# EAGLE design Test_Schematic_V3 (EAGLE 9.3.0)
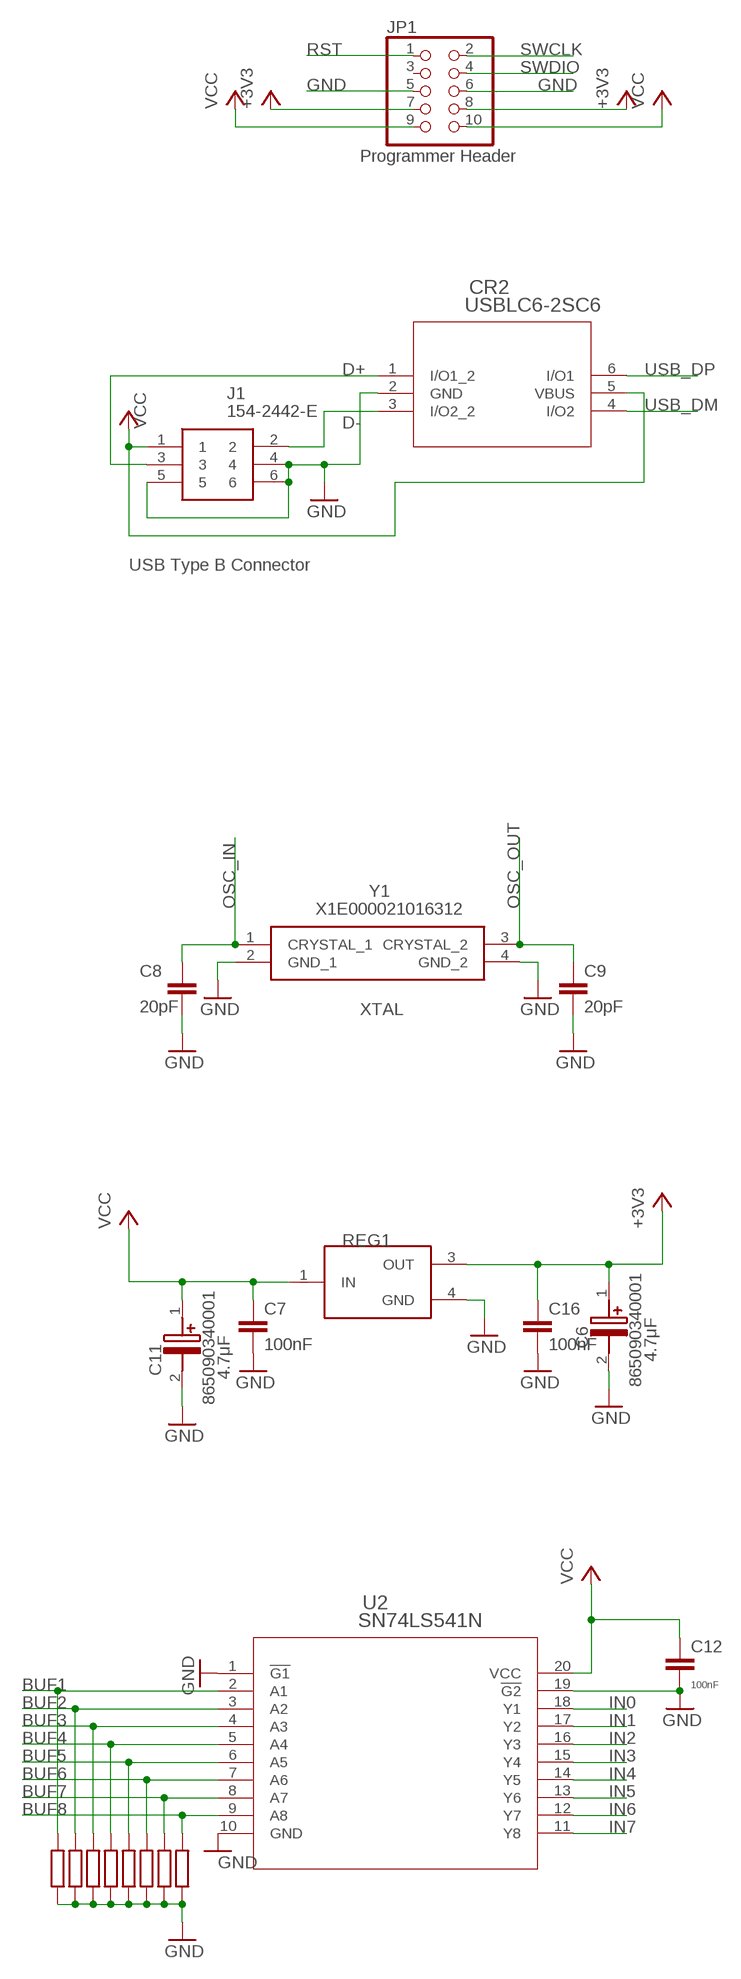
[diagram p0: schematic, sheet 1, part 1 of 2]
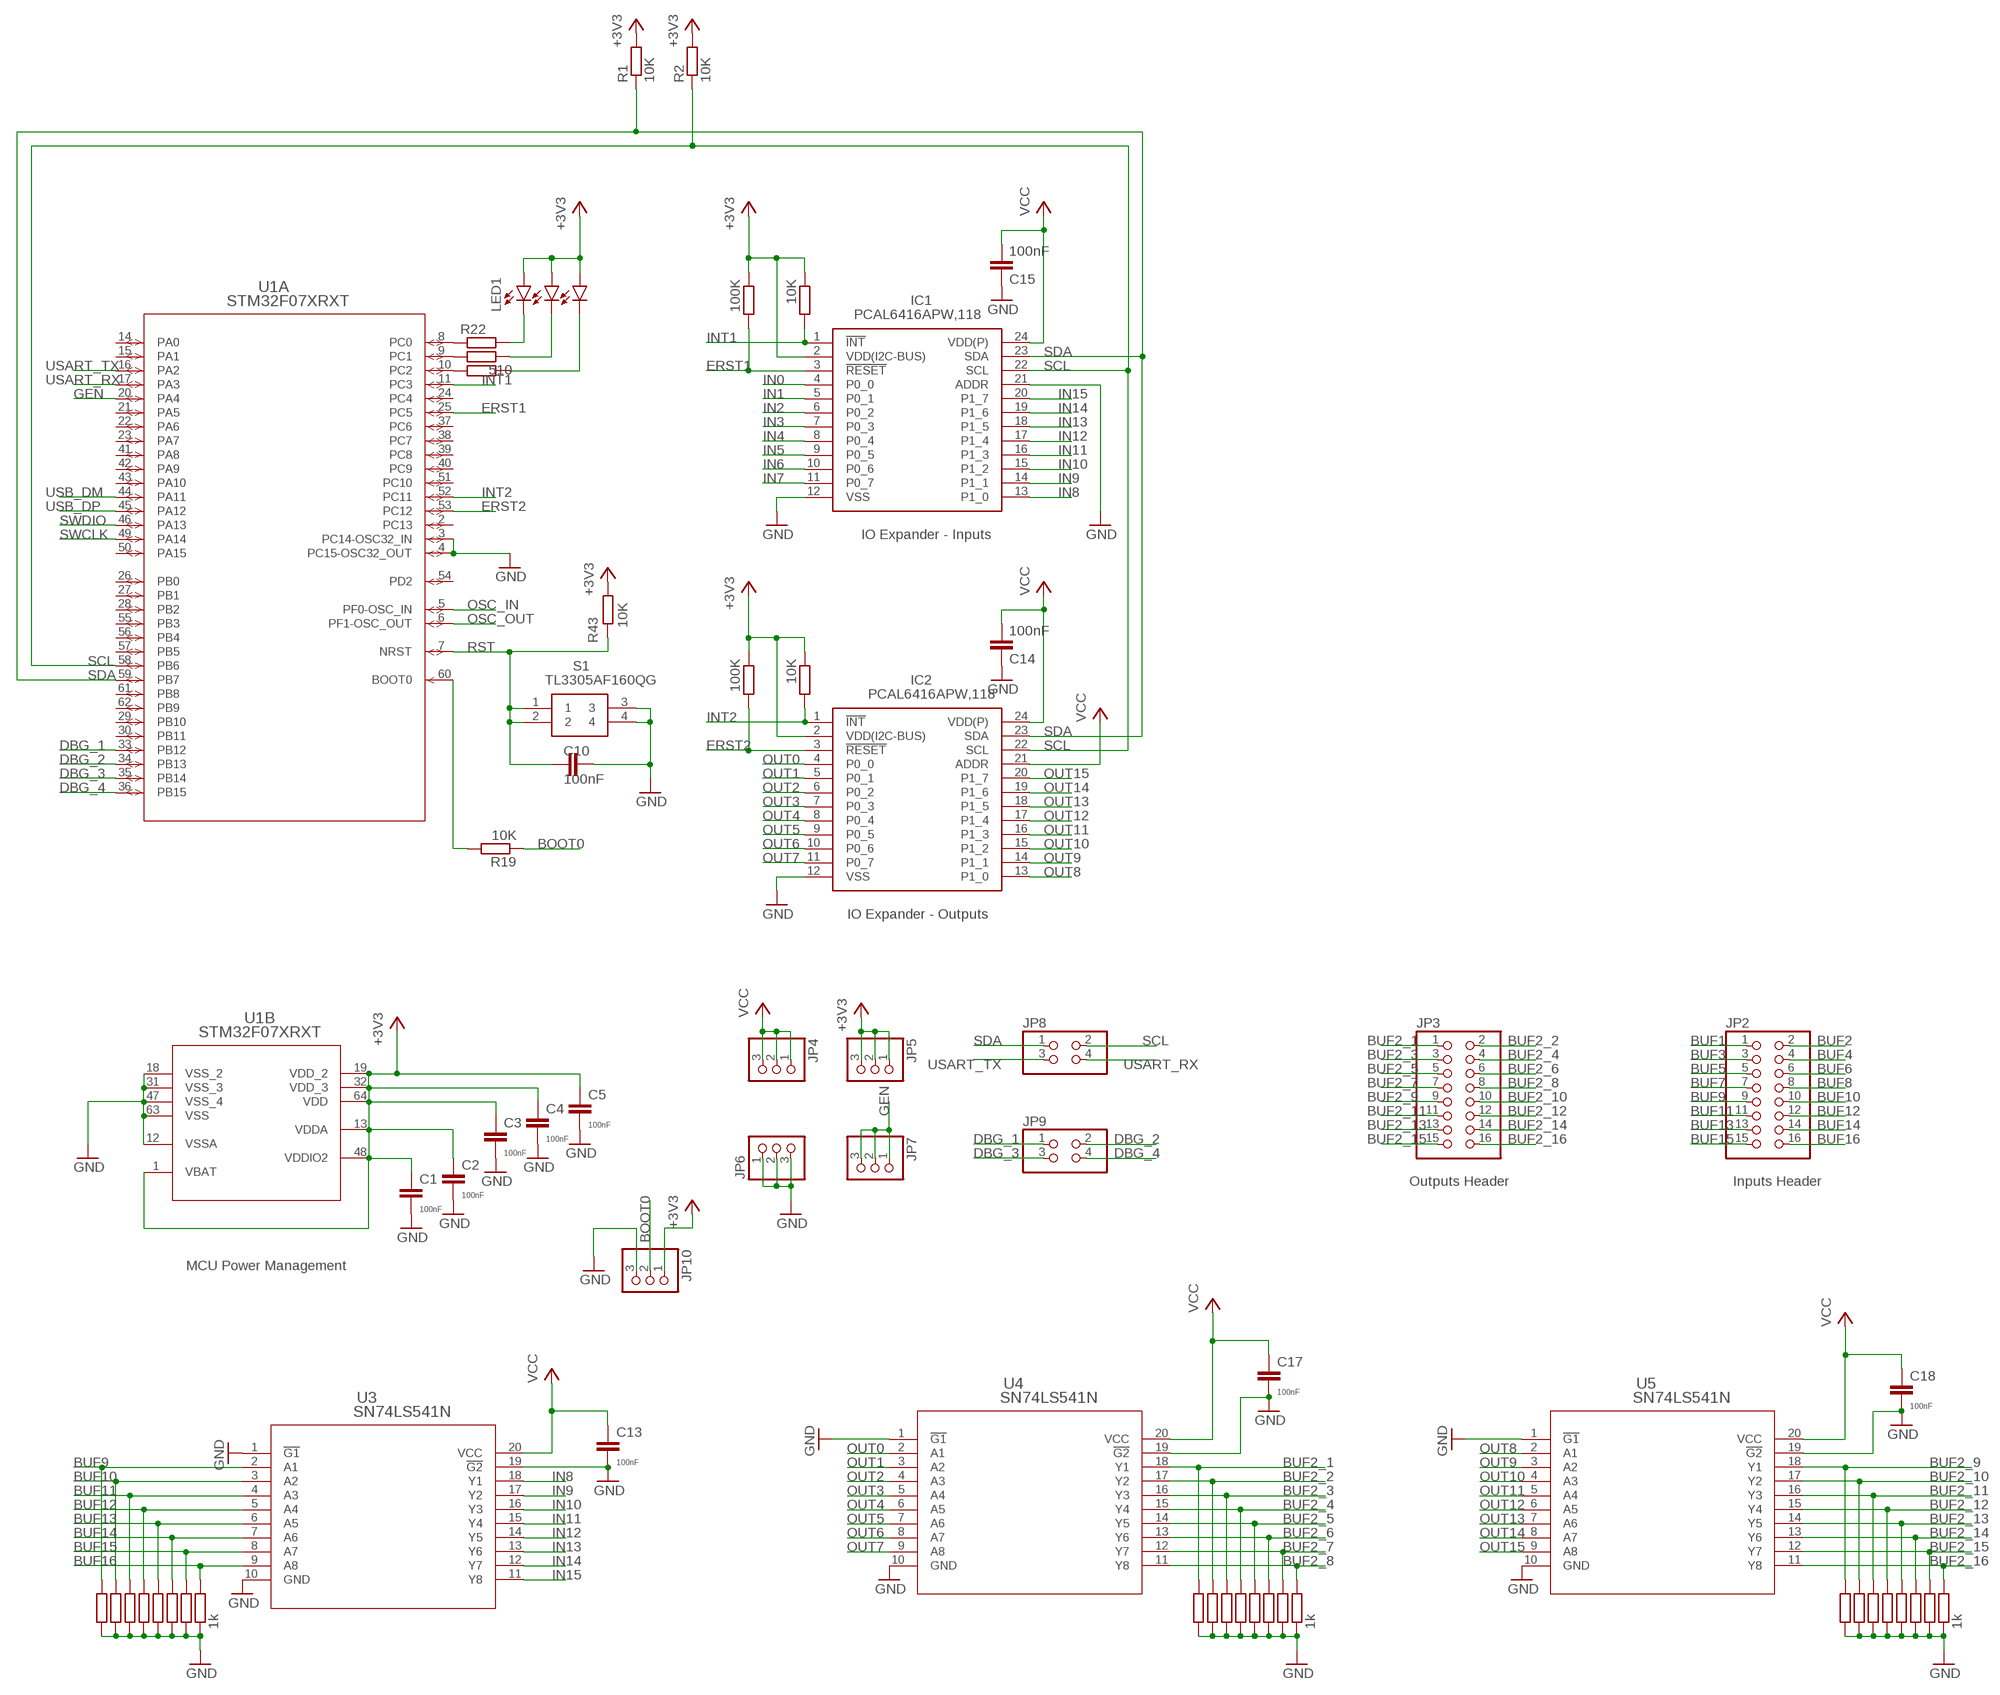
[diagram p1: schematic, sheet 1, part 2 of 2]

## Parts
C1  100nF  C-EUC1206  [C1206]
C2  100nF  C-EUC1206  [C1206]
C3  100nF  C-EUC1206  [C1206]
C4  100nF  C-EUC1206  [C1206]
C5  100nF  C-EUC1206  [C1206]
C6  865090340001  [CAPAE430X550N]
C7  100nF  C-EUC1206  [C1206]
C8  20pF  C-EUC0805K  [C0805K]
C9  20pF  C-EUC0805K  [C0805K]
C10  100nF  C-EUC1206  [C1206]
C11  865090340001  [CAPAE430X550N]
C12  100nF  C-EUC1206  [C1206]
C13  100nF  C-EUC1206  [C1206]
C14  100nF  C-EUC1206  [C1206]
C15  100nF  C-EUC1206  [C1206]
C16  100nF  C-EUC1206  [C1206]
C17  100nF  C-EUC1206  [C1206]
C18  100nF  C-EUC1206  [C1206]
CR2  USBLC6-2SC6  [SOT23-6L]
IC1  PCAL6416APW,118  [SOP65P640X110-24N]
IC2  PCAL6416APW,118  [SOP65P640X110-24N]
J1  154-2442-E  [1542442E]
JP1  PINHD-2X5  [2X05]
JP2  PINHD-2X8  [2X08]
JP3  PINHD-2X8  [2X08]
JP4  PINHD-1X3  [1X03]
JP5  PINHD-1X3  [1X03]
JP6  PINHD-1X3  [1X03]
JP7  PINHD-1X3  [1X03]
JP8  PINHD-2X2  [2X02]
JP9  PINHD-2X2  [2X02]
JP10  PINHD-1X3  [1X03]
LED1  LEDCHIP-LED0805  [CHIP-LED0805]
LED2  LEDCHIP-LED0805  [CHIP-LED0805]
LED3  LEDCHIP-LED0805  [CHIP-LED0805]
R1  10K  R-EU_R2010  [R2010]
R2  10K  R-EU_R2010  [R2010]
R11  R-EU_R0805  [R0805]
R12  R-EU_R0805  [R0805]
R13  R-EU_R0805  [R0805]
R14  R-EU_R0805  [R0805]
R15  R-EU_R0805  [R0805]
R16  R-EU_R0805  [R0805]
R17  R-EU_R0805  [R0805]
R18  1k  R-EU_R0805  [R0805]
R19  10K  R-EU_R2010  [R2010]
R20  100K  R-EU_R2010  [R2010]
R21  100K  R-EU_R2010  [R2010]
R22  R-EU_R0805  [R0805]
R23  R-EU_R0805  [R0805]
R24  510  R-EU_R0805  [R0805]
R25  10K  R-EU_R2010  [R2010]
R26  10K  R-EU_R2010  [R2010]
R27  1k  R-EU_R0805  [R0805]
R28  R-EU_R0805  [R0805]
R29  R-EU_R0805  [R0805]
R30  R-EU_R0805  [R0805]
R31  R-EU_R0805  [R0805]
R32  R-EU_R0805  [R0805]
R33  R-EU_R0805  [R0805]
R34  R-EU_R0805  [R0805]
R43  10K  R-EU_R0805  [R0805]
R44  1k  R-EU_R0805  [R0805]
R45  R-EU_R0805  [R0805]
R46  R-EU_R0805  [R0805]
R47  R-EU_R0805  [R0805]
R48  R-EU_R0805  [R0805]
R49  R-EU_R0805  [R0805]
R50  R-EU_R0805  [R0805]
R51  R-EU_R0805  [R0805]
R52  1k  R-EU_R0805  [R0805]
R53  R-EU_R0805  [R0805]
R54  R-EU_R0805  [R0805]
R55  R-EU_R0805  [R0805]
R56  R-EU_R0805  [R0805]
R57  R-EU_R0805  [R0805]
R58  R-EU_R0805  [R0805]
R59  R-EU_R0805  [R0805]
REG1  LF33ABDT  [DPAK]
S1  TL3305AF160QG  [TL3305AF160QG]
U1  STM32F07XRXT  [LQFP64-10X10MM]
U2  SN74LS541N  [N20]
U3  SN74LS541N  [N20]
U4  SN74LS541N  [N20]
U5  SN74LS541N  [N20]
Y1  X1E000021016312  [TSX-3225_2]

## Nets
+3V3: C1.1 C2.1 C3.1 C4.1 C5.1 C6.1(+) C16.1 IC1.2(VDD(I2C-BUS)) IC2.2(VDD(I2C-BUS)) JP1.7 JP1.8 JP5.1 JP5.2 JP5.3 JP10.1 LED1.A LED2.A LED3.A R1.2 R2.2 R20.1 R21.1 R25.1 R26.1 R43.1 REG1.3(OUT) U1.1(B:VBAT) U1.13(B:VDDA) U1.19(B:VDD_2) U1.32(B:VDD_3) U1.48(B:VDDIO2) U1.64(B:VDD)
BOOT0: JP10.2 R19.1
BUF1: JP2.1 R11.2 U2.2(A1)
BUF2: JP2.2 R12.2 U2.3(A2)
BUF2_1: JP3.1 R51.2 U4.18(Y1)
BUF2_2: JP3.2 R50.2 U4.17(Y2)
BUF2_3: JP3.3 R49.2 U4.16(Y3)
BUF2_4: JP3.4 R48.2 U4.15(Y4)
BUF2_5: JP3.5 R47.2 U4.14(Y5)
BUF2_6: JP3.6 R46.1 U4.13(Y6)
BUF2_7: JP3.7 R45.2 U4.12(Y7)
BUF2_8: JP3.8 R44.2 U4.11(Y8)
BUF2_9: JP3.9 R59.2 U5.18(Y1)
BUF2_10: JP3.10 R58.2 U5.17(Y2)
BUF2_11: JP3.11 R57.2 U5.16(Y3)
BUF2_12: JP3.12 R56.2 U5.15(Y4)
BUF2_13: JP3.13 R55.2 U5.14(Y5)
BUF2_14: JP3.14 R54.1 U5.13(Y6)
BUF2_15: JP3.15 R53.2 U5.12(Y7)
BUF2_16: JP3.16 R52.2 U5.11(Y8)
BUF3: JP2.3 R13.2 U2.4(A3)
BUF4: JP2.4 R14.2 U2.5(A4)
BUF5: JP2.5 R15.2 U2.6(A5)
BUF6: JP2.6 R16.2 U2.7(A6)
BUF7: JP2.7 R17.2 U2.8(A7)
BUF8: JP2.8 R18.2 U2.9(A8)
BUF9: JP2.9 R34.2 U3.2(A1)
BUF10: JP2.10 R33.2 U3.3(A2)
BUF11: JP2.11 R32.2 U3.4(A3)
BUF12: JP2.12 R31.2 U3.5(A4)
BUF13: JP2.13 R30.2 U3.6(A5)
BUF14: JP2.14 R29.1 U3.7(A6)
BUF15: JP2.15 R28.2 U3.8(A7)
BUF16: JP2.16 R27.2 U3.9(A8)
D+: CR2.1(I/O1_2) J1.3
D-: CR2.3(I/O2_2) J1.2
DBG_1: JP9.1 U1.33(A:PB12)
DBG_2: JP9.2 U1.34(A:PB13)
DBG_3: JP9.3 U1.35(A:PB14)
DBG_4: JP9.4 U1.36(A:PB15)
ERST1: IC1.3(!RESET) R20.2 U1.25(A:PC5)
ERST2: IC2.3(!RESET) R21.2 U1.53(A:PC12)
GEN: JP7.1 JP7.2 JP7.3 U1.20(A:PA4)
GND: C1.2 C2.2 C3.2 C4.2 C5.2 C6.2(-) C7.2 C8.2 C9.2 C10.2 C11.2(-) C12.2 C13.2 C14.1 C15.1 C16.2 C17.2 C18.2 CR2.2(GND) IC1.12(VSS) IC1.21(ADDR) IC2.12(VSS) J1.4 J1.5 J1.6 JP1.5 JP1.6 JP6.1 JP6.2 JP6.3 JP10.3 R11.1 R12.1 R13.1 R14.1 R15.1 R16.1 R17.1 R18.1 R27.1 R28.1 R29.2 R30.1 R31.1 R32.1 R33.1 R34.1 R44.1 R45.1 R46.2 R47.1 R48.1 R49.1 R50.1 R51.1 R52.1 R53.1 R54.2 R55.1 R56.1 R57.1 R58.1 R59.1 REG1.4(GND) S1.3 S1.4 U1.3(A:PC14-OSC32_IN) U1.4(A:PC15-OSC32_OUT) U1.12(B:VSSA) U1.18(B:VSS_2) U1.31(B:VSS_3) U1.47(B:VSS_4) U1.63(B:VSS) U2.1(!G1) U2.10(GND) U2.19(!G2) U3.1(!G1) U3.10(GND) U3.19(!G2) U4.1(!G1) U4.10(GND) U4.19(!G2) U5.1(!G1) U5.10(GND) U5.19(!G2) Y1.2(GND_1) Y1.4(GND_2)
IN0: IC1.4(P0_0) U2.18(Y1)
IN1: IC1.5(P0_1) U2.17(Y2)
IN2: IC1.6(P0_2) U2.16(Y3)
IN3: IC1.7(P0_3) U2.15(Y4)
IN4: IC1.8(P0_4) U2.14(Y5)
IN5: IC1.9(P0_5) U2.13(Y6)
IN6: IC1.10(P0_6) U2.12(Y7)
IN7: IC1.11(P0_7) U2.11(Y8)
IN8: IC1.13(P1_0) U3.18(Y1)
IN9: IC1.14(P1_1) U3.17(Y2)
IN10: IC1.15(P1_2) U3.16(Y3)
IN11: IC1.16(P1_3) U3.15(Y4)
IN12: IC1.17(P1_4) U3.14(Y5)
IN13: IC1.18(P1_5) U3.13(Y6)
IN14: IC1.19(P1_6) U3.12(Y7)
IN15: IC1.20(P1_7) U3.11(Y8)
INT1: IC1.1(!INT) R26.2 U1.11(A:PC3)
INT2: IC2.1(!INT) R25.2 U1.52(A:PC11)
N$1: R22.1 U1.8(A:PC0)
N$2: R19.2 U1.60(A:BOOT0)
N$3: LED1.C R22.2
N$4: R23.1 U1.9(A:PC1)
N$5: LED2.C R23.2
N$6: LED3.C R24.2
N$8: R24.1 U1.10(A:PC2)
OSC_IN: C8.1 U1.5(A:PF0-OSC_IN) Y1.1(CRYSTAL_1)
OSC_OUT: C9.1 U1.6(A:PF1-OSC_OUT) Y1.3(CRYSTAL_2)
OUT0: IC2.4(P0_0) U4.2(A1)
OUT1: IC2.5(P0_1) U4.3(A2)
OUT2: IC2.6(P0_2) U4.4(A3)
OUT3: IC2.7(P0_3) U4.5(A4)
OUT4: IC2.8(P0_4) U4.6(A5)
OUT5: IC2.9(P0_5) U4.7(A6)
OUT6: IC2.10(P0_6) U4.8(A7)
OUT7: IC2.11(P0_7) U4.9(A8)
OUT8: IC2.13(P1_0) U5.2(A1)
OUT9: IC2.14(P1_1) U5.3(A2)
OUT10: IC2.15(P1_2) U5.4(A3)
OUT11: IC2.16(P1_3) U5.5(A4)
OUT12: IC2.17(P1_4) U5.6(A5)
OUT13: IC2.18(P1_5) U5.7(A6)
OUT14: IC2.19(P1_6) U5.8(A7)
OUT15: IC2.20(P1_7) U5.9(A8)
RST: C10.1 JP1.1 R43.2 S1.1 S1.2 U1.7(A:NRST)
SCL: IC1.22(SCL) IC2.22(SCL) JP8.2 R2.1 U1.58(A:PB6)
SDA: IC1.23(SDA) IC2.23(SDA) JP8.1 R1.1 U1.59(A:PB7)
SWCLK: JP1.2 U1.49(A:PA14)
SWDIO: JP1.4 U1.46(A:PA13)
USART_RX: JP8.4 U1.17(A:PA3)
USART_TX: JP8.3 U1.16(A:PA2)
USB_DM: CR2.4(I/O2) U1.44(A:PA11)
USB_DP: CR2.6(I/O1) U1.45(A:PA12)
VCC: C7.1 C11.1(+) C12.1 C13.1 C14.2 C15.2 C17.1 C18.1 CR2.5(VBUS) IC1.24(VDD(P)) IC2.21(ADDR) IC2.24(VDD(P)) J1.1 JP1.9 JP1.10 JP4.1 JP4.2 JP4.3 REG1.1(IN) U2.20(VCC) U3.20(VCC) U4.20(VCC) U5.20(VCC)
Unconnected: JP1.3 U1.2(A:PC13) U1.14(A:PA0) U1.15(A:PA1) U1.21(A:PA5) U1.22(A:PA6) U1.23(A:PA7) U1.24(A:PC4) U1.26(A:PB0) U1.27(A:PB1) U1.28(A:PB2) U1.29(A:PB10) U1.30(A:PB11) U1.37(A:PC6) U1.38(A:PC7) U1.39(A:PC8) U1.40(A:PC9) U1.41(A:PA8) U1.42(A:PA9) U1.43(A:PA10) U1.50(A:PA15) U1.51(A:PC10) U1.54(A:PD2) U1.55(A:PB3) U1.56(A:PB4) U1.57(A:PB5) U1.61(A:PB8) U1.62(A:PB9)

## Library data of the parts
C1-C5 C7-C10 C12-C18 = rcl:C-EU: CAPACITOR, European symbol; SPICEPREFIX: C
C6 C11 = 865090340001:865090340001: Wurth Elektronik 4.7uF 16 V dc Aluminium Electrolytic Capacitor, WCAP-ASLU Series 1000h 5.5 (Dia.) x 3.85mm Source: Datasheet <http://uk.rs-online.com/web/p/products/8387942>; CAPACITANCE: 4.7μF; DESCRIPTION: Wurth Elektronik 4.7uF 16 V dc Aluminium Electrolytic Capacitor, WCAP-ASLU Series 1000h 5.5 (Dia.) x 3.85mm; HEIGHT: 5.5mm; MANUFACTURER_NAME: Wurth Elektronik; MANUFACTURER_PART_NUMBER: 865090340001; MOUSER_PART_NUMBER: 710-865090340001; MOUSER_PRICE-STOCK: https://www.mouser.com/Search/Refine.aspx?Keyword=710-865090340001; RS_PART_NUMBER: 8387942P; RS_PRICE-STOCK: http://uk.rs-online.com/web/p/products/8387942P
CR2 = USBLC6-2SC6:USBLC6-2SC6; MANUFACTURER_PART_NUMBER: USBLC62SC6; VENDOR: STMicroelectronics
IC1 = PCAL6416APW_118:PCAL6416APW,118: NXP - PCAL6416APW,118 - I/O EXPANDER, 16BIT, 400KHZ, TSSOP-24 Source: Datasheet <https://www.nxp.com/docs/en/data-sheet/PCAL6416A.pdf>; CUSTOM_DESCRIPTION: IO Expander - Inputs; DESCRIPTION: NXP - PCAL6416APW,118 - I/O EXPANDER, 16BIT, 400KHZ, TSSOP-24; HEIGHT: 1.1mm; MANUFACTURER_NAME: NXP; MANUFACTURER_PART_NUMBER: PCAL6416APW,118; MOUSER_PART_NUMBER: 771-PCAL6416APW118
IC2 = PCAL6416APW_118:PCAL6416APW,118: NXP - PCAL6416APW,118 - I/O EXPANDER, 16BIT, 400KHZ, TSSOP-24 Source: Datasheet <https://www.nxp.com/docs/en/data-sheet/PCAL6416A.pdf>; CUSTOM_DESCRIPTION: IO Expander - Outputs; DESCRIPTION: NXP - PCAL6416APW,118 - I/O EXPANDER, 16BIT, 400KHZ, TSSOP-24; HEIGHT: 1.1mm; MANUFACTURER_NAME: NXP; MANUFACTURER_PART_NUMBER: PCAL6416APW,118; MOUSER_PART_NUMBER: 771-PCAL6416APW118
J1 = SamacSys_Parts:154-2442-E: USB Connectors B TYPE 4P WHITE Source: Datasheet <https://componentsearchengine.com/Datasheets/1/154-2442-E.pdf>; CUSTOM_DESCRIPTION: USB Type B Connector; DESCRIPTION: USB Connectors B TYPE 4P WHITE; HEIGHT: 12mm; MANUFACTURER_NAME: Kobiconn; MANUFACTURER_PART_NUMBER: 154-2442-E; MOUSER_PART_NUMBER: 154-2442-E; MOUSER_PRICE-STOCK: https://www.mouser.com/Search/Refine.aspx?Keyword=154-2442-E
JP1 = pinhead:PINHD-2X5: PIN HEADER; HEADER: Programmer Header
JP2 = pinhead:PINHD-2X8: PIN HEADER; CUSTOM_DESCRIPTION: Inputs Header
JP3 = pinhead:PINHD-2X8: PIN HEADER; CUSTOM_DESCRIPTION: Outputs Header
JP4-JP7 JP10 = pinhead:PINHD-1X3: PIN HEADER
JP8 JP9 = pinhead:PINHD-2X2: PIN HEADER
LED1-LED3 = led:LED: LED OSRAM: - CHIPLED LG R971, LG N971, LY N971, LG Q971, LY Q971, LO R971, LY R971 LH N974, LH R974 LS Q976, LO Q976, LY Q976 LO Q996 - Hyper CHIPLED LW Q18S LB Q993, LB Q99A, LB R99A - SideLED LS A670, LO A670, LY A670, LG A670, LP A670 LB A673, LV A673, LT A673, LW A673 LH A674 LY A675 LS A676, LA A676, LO A676, LY A676, LW A676 LS A679, LY A679, LG A679 - Hyper Micro SIDELED® LS Y876, LA Y876, LO Y876, LY Y876 LT Y87S - SmartLED LW L88C, LW L88S LB L89C, LB L89S, LG L890 LS L89K, LO L89K, LY L89K LS L896, LA L896, LO L896, LY L896 - TOPLED LS T670, LO T670, LY T670, LG T670, LP T670 LSG T670, LSP T670, LSY T670, LOP T670, LYG T670 LG T671, LOG T671, LSG T671 LB T673, LV T673, LT T673, LW T673 LH T674 LS T676, LA T676, LO T676, LY T676, LB T676, LH T676, LSB T676, LW T676 LB T67C, LV T67C, LT T67C, LS T67K, LO T67K, LY T67K, LW E67C LS E67B, LA E67B, LO E67B, LY E67B, LB E67C, LV E67C, LT E67C LW T67C LS T679, LY T679, LG T679 LS T770, LO T770, LY T770, LG T770, LP T770 LB T773, LV T773, LT T773, LW T773 LH T774 LS E675, LA E675, LY E675, LS T675 LS T776, LA T776, LO T776, LY T776, LB T776 LHGB T686 LT T68C, LB T68C - Hyper Mini TOPLED® LB M676 - Mini TOPLED Santana® LG M470 LS M47K, LO M47K, LY M47K Source: http://www.osram.convergy.de LUXEON: - LUMILED® LXK2-PW12-R00, LXK2-PW12-S00, LXK2-PW14-U00, LXK2-PW14-V00 LXK2-PM12-R00, LXK2-PM12-S00, LXK2-PM14-U00 LXK2-PE12-Q00, LXK2-PE12-R00, LXK2-PE12-S00, LXK2-PE14-T00, LXK2-PE14-U00 LXK2-PB12-K00, LXK2-PB12-L00, LXK2-PB12-M00, LXK2-PB14-N00, LXK2-PB14-P00, LXK2-PB14-Q00 LXK2-PR12-L00, LXK2-PR12-M00, LXK2-PR14-Q00, LXK2-PR14-R00 LXK2-PD12-Q00, LXK2-PD12-R00, LXK2-PD12-S00 LXK2-PH12-R00, LXK2-PH12-S00 LXK2-PL12-P00, LXK2-PL12-Q00, LXK2-PL12-R00 Source: www.luxeon.com KINGBRIGHT: KA-3528ASYC Source: www.kingbright.com
R1 R2 R11-R34 R43-R59 = rcl:R-EU_: RESISTOR, European symbol; SPICEPREFIX: R
REG1 = LF33ABDT-TR:LF33ABDT: LF33ABDT-TR DPAK SMD 3.3V Regulator created for the development board
S1 = TL3305AF160QG:TL3305AF160QG: Tactile Switches 50mA 12VDC SPST, NO 3.8mm Act 160gf Source: Datasheet <https://componentsearchengine.com/Datasheets/1/TL3305AF160QG.pdf>; DESCRIPTION: Tactile Switches 50mA 12VDC SPST, NO 3.8mm Act 160gf; HEIGHT: mm; MANUFACTURER_NAME: E-Switch; MANUFACTURER_PART_NUMBER: TL3305AF160QG; MOUSER_PART_NUMBER: 612-TL3305AF160QG; MOUSER_PRICE-STOCK: https://www.mouser.com/Search/Refine.aspx?Keyword=612-TL3305AF160QG
U1 = STM32F072RBTx:STM32F07XRXT; CUSTOM_DESCRIPTION: MCU Power Management; MANUFACTURER_PART_NUMBER: STM32F07XRXT; VENDOR: STMicroelectronics
U2-U5 = SN74LS541N:SN74LS541N; MANUFACTURER_PART_NUMBER: SN74LS541N; VENDOR: Texas Instruments
Y1 = X1E000021016312:X1E000021016312: Crystal Unit 32MHz, +/-10ppm, 4-Pin TSX-3225, 3.2 x 2.5 x 0.6mm Source: Datasheet <https://docs-emea.rs-online.com/webdocs/14a1/0900766b814a1006.pdf>; CUSTOM_DESCRIPTION: XTAL; DESCRIPTION: Crystal Unit 32MHz, +/-10ppm, 4-Pin TSX-3225, 3.2 x 2.5 x 0.6mm; HEIGHT: mm; MANUFACTURER_NAME: Epson Timing; MANUFACTURER_PART_NUMBER: X1E000021016312; RS_PART_NUMBER: 9047556P; RS_PRICE-STOCK: http://uk.rs-online.com/web/p/products/9047556P

## Board
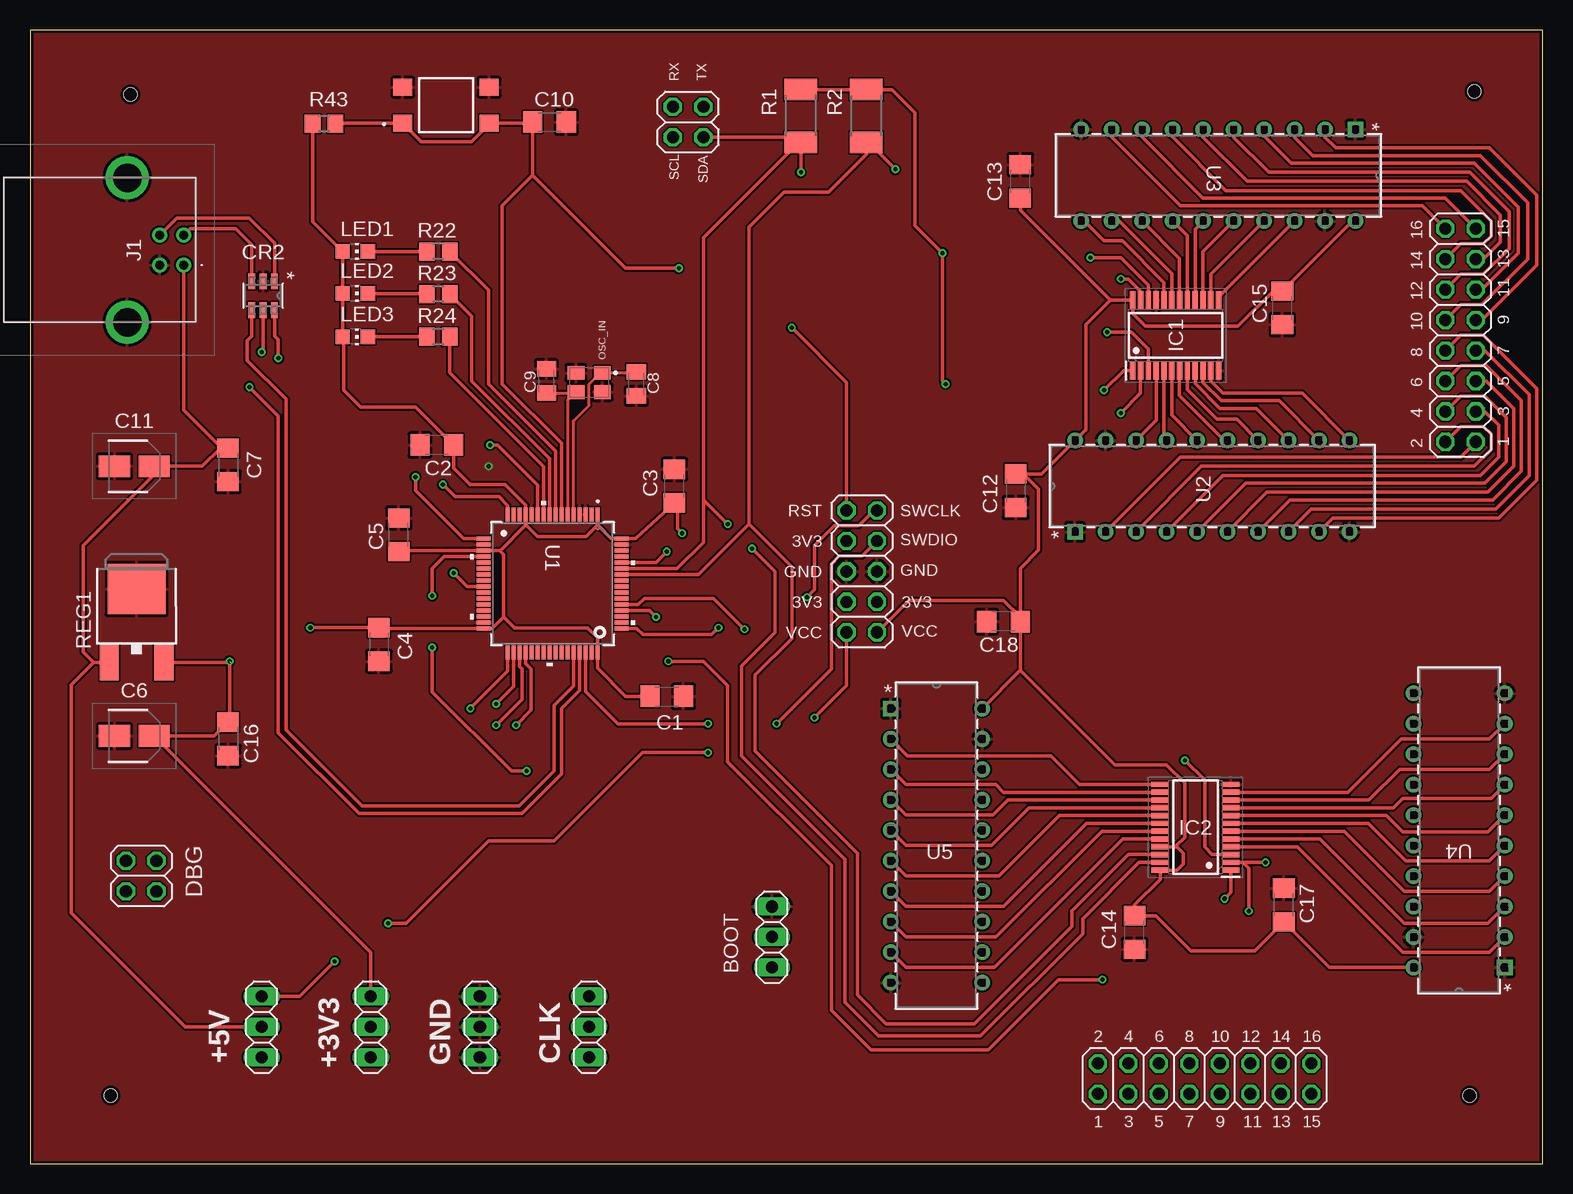
[diagram p2: board, top side]
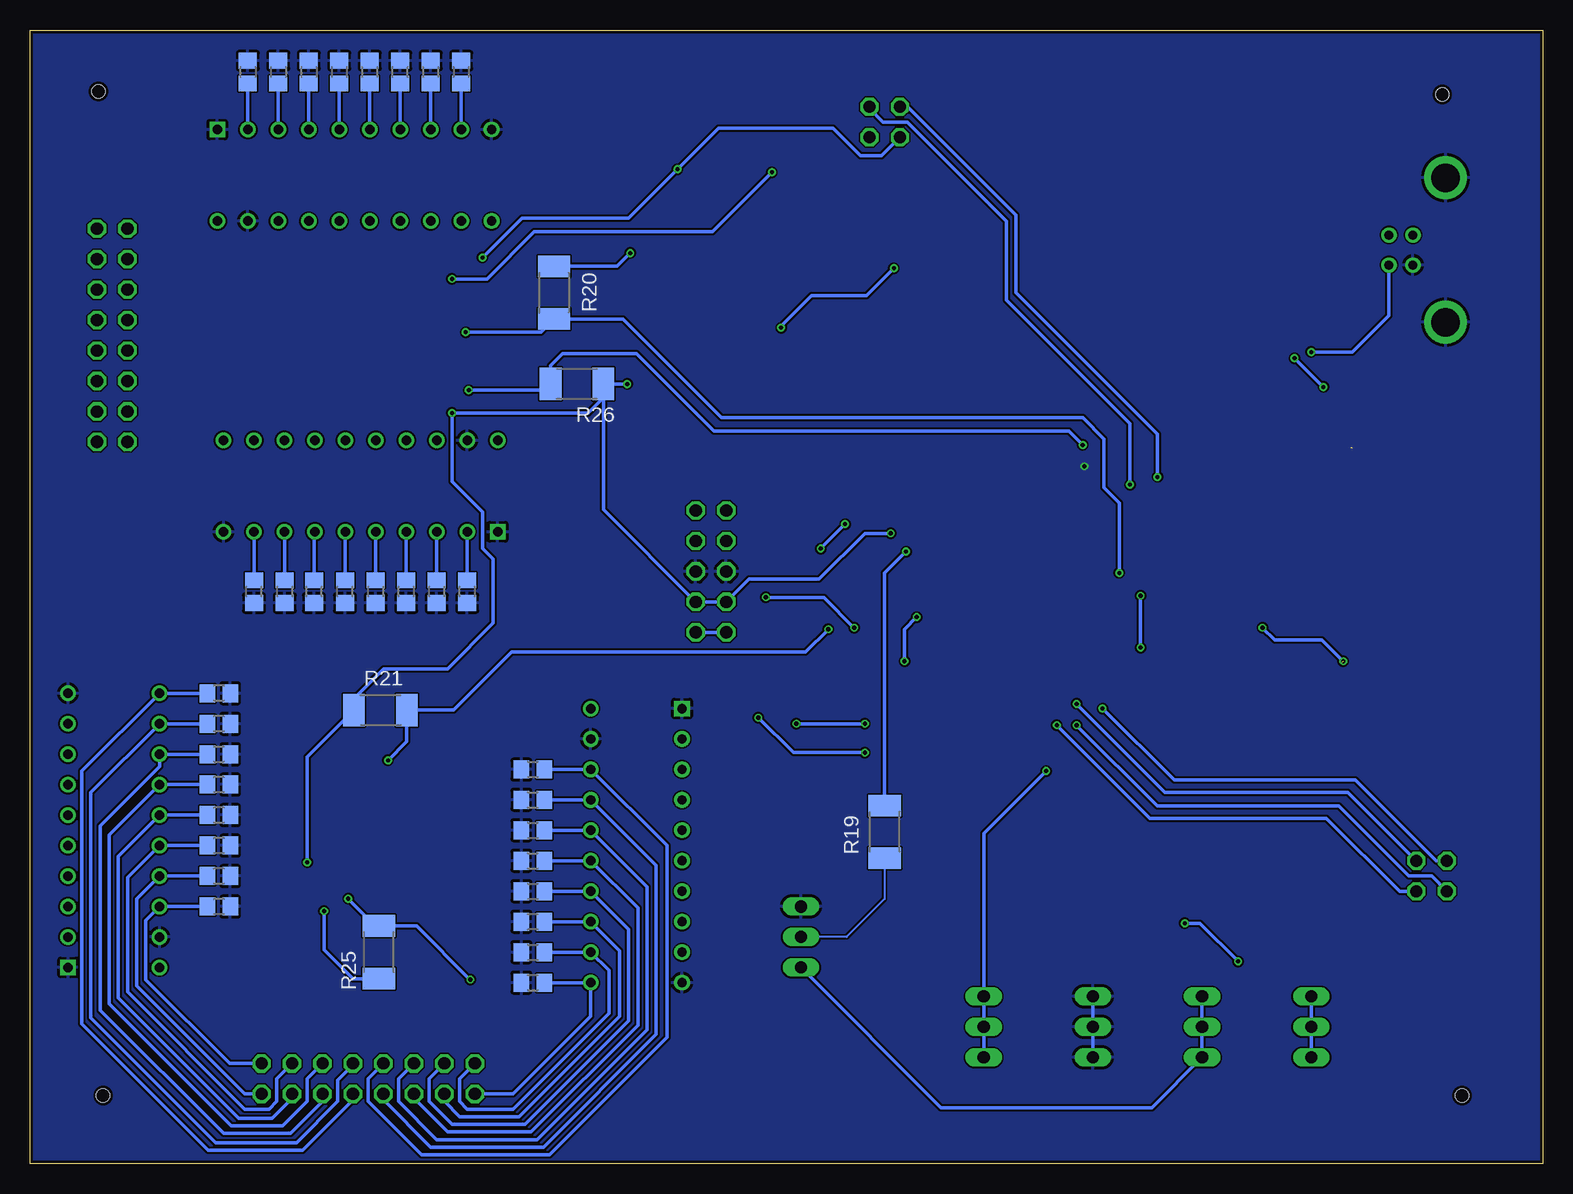
[diagram p3: board, bottom side, seen from below]

Size 126.11 x 94.54 mm. Coordinates in mm from the lower left corner, seen from the top.
Outline: 0,0 126.11,0 126.11,94.54 0,94.54 0,0
Copper layers (1*16): Top 0.035mm / dielectric 1.5mm / Bottom 0.035mm
Design rules "ITead_rule *": minimum track width 6mil, minimum drill 0.3mm, track to track 6mil, track to pad 6mil, pad to pad 6mil, via to via 6mil, smd to smd 0mil, copper to edge 10mil, drill to drill 10mil, minimum pad ring 10mil, minimum via ring 6mil, stop-mask expansion 2mil, vias tented up to drill 100mil, thermal gap 10mil
Holes 1.1 mm at 6.73,5.71 120.02,5.71 120.4,89.41 8.38,89.15

### Footprints (pad centres in the part's own frame; a part is rotated, then mirrored left to right if it is on the bottom)
C1206 = smd 1.6 x 1.8: 1 -1.4,0; 2 1.4,0
CAPAE430X550N = smd 2.6 x 1.8: 1 -1.65,0; 2 1.65,0
C0805K = smd 1.3 x 1.6: 1 -1,0; 2 1,0
SOT23-6L = smd 1.321 x 0.559: 1 -1.194,0.95; 2 -1.194,0; 3 -1.194,-0.95; 4 1.194,-0.95; 5 1.194,0; 6 1.194,0.95
SOP65P640X110-24N = smd 1.475 x 0.45: 1 -2.938,3.575; 2 -2.938,2.925; 3 -2.938,2.275; 4 -2.938,1.625; 5 -2.938,0.975; 6 -2.938,0.325; 7 -2.938,-0.325; 8 -2.938,-0.975; 9 -2.938,-1.625; 10 -2.938,-2.275; 11 -2.938,-2.925; 12 -2.938,-3.575; 13 2.938,-3.575; 14 2.938,-2.925; 15 2.938,-2.275; 16 2.938,-1.625; 17 2.938,-0.975; 18 2.938,-0.325; 19 2.938,0.325; 20 2.938,0.975; 21 2.938,1.625; 22 2.938,2.275; 23 2.938,2.925; 24 2.938,3.575
1542442E = drill 0.75 pad 1.2: 1 1.25,6.725; 2 -1.25,6.725; 3 -1.25,4.725; 4 1.25,4.725 | drill 2.38 pad 3.57: 5 -6.02,2.015; 6 6.02,2.015
2X05 = drill 1.016 octagon: 1 -5.08,-1.27; 2 -5.08,1.27; 3 -2.54,-1.27; 4 -2.54,1.27; 5 0,-1.27; 6 0,1.27; 7 2.54,-1.27; 8 2.54,1.27; 9 5.08,-1.27; 10 5.08,1.27
2X08 = drill 1.016 octagon: 1 -8.89,-1.27; 2 -8.89,1.27; 3 -6.35,-1.27; 4 -6.35,1.27; 5 -3.81,-1.27; 6 -3.81,1.27; 7 -1.27,-1.27; 8 -1.27,1.27; 9 1.27,-1.27; 10 1.27,1.27; 11 3.81,-1.27; 12 3.81,1.27; 13 6.35,-1.27; 14 6.35,1.27; 15 8.89,-1.27; 16 8.89,1.27
1X03 = drill 1.016 long: 1 -2.54,0; 2 0,0; 3 2.54,0
2X02 = drill 1.016 octagon: 1 -1.27,-1.27; 2 -1.27,1.27; 3 1.27,-1.27; 4 1.27,1.27
CHIP-LED0805 = smd 1.2 x 1.2: A 0,-1.05; C 0,1.05
R2010 = smd 1.8 x 2.7: 1 -2.2,0; 2 2.2,0
R0805 = smd 1.3 x 1.5: 1 -0.95,0; 2 0.95,0
DPAK = smd 1.6 x 3: 1 -2.28,-4.04; 3 2.28,-4.04 | smd 4.826 x 4.191: 4 0,2.096
TL3305AF160QG = smd 1.6 x 1.4: 1 -3.6,-1.5; 2 3.6,-1.5; 3 -3.6,1.5; 4 3.6,1.5
LQFP64-10X10MM = smd 1.194 x 0.305: 1 -5.75,3.75; 2 -5.75,3.25; 3 -5.75,2.75; 4 -5.75,2.25; 5 -5.75,1.75; 6 -5.75,1.25; 7 -5.75,0.75; 8 -5.75,0.25; 9 -5.75,-0.25; 10 -5.75,-0.75; 11 -5.75,-1.25; 12 -5.75,-1.75; 13 -5.75,-2.25; 14 -5.75,-2.75; 15 -5.75,-3.25; 16 -5.75,-3.75; 33 5.75,-3.75; 34 5.75,-3.25; 35 5.75,-2.75; 36 5.75,-2.25; 37 5.75,-1.75; 38 5.75,-1.25; 39 5.75,-0.75; 40 5.75,-0.25; 41 5.75,0.25; 42 5.75,0.75; 43 5.75,1.25; 44 5.75,1.75; 45 5.75,2.25; 46 5.75,2.75; 47 5.75,3.25; 48 5.75,3.75 | smd 0.305 x 1.194: 17 -3.75,-5.75; 18 -3.25,-5.75; 19 -2.75,-5.75; 20 -2.25,-5.75; 21 -1.75,-5.75; 22 -1.25,-5.75; 23 -0.75,-5.75; 24 -0.25,-5.75; 25 0.25,-5.75; 26 0.75,-5.75; 27 1.25,-5.75; 28 1.75,-5.75; 29 2.25,-5.75; 30 2.75,-5.75; 31 3.25,-5.75; 32 3.75,-5.75; 49 3.75,5.75; 50 3.25,5.75; 51 2.75,5.75; 52 2.25,5.75; 53 1.75,5.75; 54 1.25,5.75; 55 0.75,5.75; 56 0.25,5.75; 57 -0.25,5.75; 58 -0.75,5.75; 59 -1.25,5.75; 60 -1.75,5.75; 61 -2.25,5.75; 62 -2.75,5.75; 63 -3.25,5.75; 64 -3.75,5.75
N20 = drill 0.787 pad 1.295 square: 1 -7.62,22.86 | drill 0.787 pad 1.295: 2 -7.62,20.32; 3 -7.62,17.78; 4 -7.62,15.24; 5 -7.62,12.7; 6 -7.62,10.16; 7 -7.62,7.62; 8 -7.62,5.08; 9 -7.62,2.54; 10 -7.62,0; 11 0,0; 12 0,2.54; 13 0,5.08; 14 0,7.62; 15 0,10.16; 16 0,12.7; 17 0,15.24; 18 0,17.78; 19 0,20.32; 20 0,22.86
TSX-3225_2 = smd 1.4 x 1.15: 1 -1.1,-0.8; 2 1.1,-0.8; 3 1.1,0.8; 4 -1.1,0.8

### Placement (x,y rotation side)
C1  53.09,38.99 0 top
C2  33.91,59.94 180 top
C3  53.72,56.52 90 top
C4  29.08,43.31 270 top
C5  30.73,52.45 90 top
C6  8.7,35.69 180 top
C7  16.51,58.29 270 top
C8  50.55,65.02 270 top
C9  43.05,65.28 90 top
C10  43.31,86.87 0 top
C11  8.7,58.17 180 top
C12  82.17,56.13 270 top
C13  82.55,81.91 90 top
C14  92.07,19.3 90 top
C15  104.39,71.37 90 top
C16  16.51,35.43 270 top
C17  104.52,21.59 90 top
C18  81.15,45.21 180 top
CR2  19.43,72.39 270 top
IC1  95.5,69.09 90 top
IC2  97.16,28.07 180 top
J1  6.1,76.2 270 top
JP1  69.34,49.4 270 top
JP2  119.25,69.09 90 top
JP3  97.92,7.11 180 top
JP4  19.3,11.43 90 top
JP5  28.41,11.43 90 top
JP6  37.51,11.43 90 top
JP7  46.61,11.43 90 top
JP8  54.86,86.87 90 top
JP9  9.27,24 270 top
JP10  61.85,18.92 90 top
LED1  27.11,76.07 270 top
LED2  27.11,72.58 270 top
LED3  27.11,68.96 270 top
R1  64.26,87.38 90 top
R2  69.72,87.38 90 top
R11  89.66,47.72 90 bottom
R12  92.2,47.72 90 bottom
R13  94.74,47.72 90 bottom
R14  97.28,47.72 90 bottom
R15  99.85,47.72 90 bottom
R16  102.43,47.72 90 bottom
R17  104.87,47.72 90 bottom
R18  107.44,47.72 90 bottom
R19  54.86,27.69 90 bottom
R20  82.42,72.64 270 bottom
R21  96.9,37.85 0 bottom
R22  34.04,76.07 180 top
R23  34.04,72.52 180 top
R24  34.04,68.96 180 top
R25  97.03,17.65 90 bottom
R26  80.52,65.02 180 bottom
R27  90.17,91.03 270 bottom
R28  92.71,91.03 270 bottom
R29  95.25,91.03 90 bottom
R30  97.79,91.03 270 bottom
R31  100.33,91.03 270 bottom
R32  102.87,91.03 270 bottom
R33  105.41,91.03 270 bottom
R34  107.95,91.03 270 bottom
R43  24.51,86.74 0 top
R44  110.36,39.24 180 bottom
R45  110.36,36.7 180 bottom
R46  110.36,34.16 0 bottom
R47  110.36,31.62 180 bottom
R48  110.36,29.08 180 bottom
R49  110.36,26.54 180 bottom
R50  110.36,24 180 bottom
R51  110.36,21.46 180 bottom
R52  84.2,15.11 0 bottom
R53  84.2,17.65 0 bottom
R54  84.2,20.19 180 bottom
R55  84.2,22.73 0 bottom
R56  84.2,25.27 0 bottom
R57  84.2,27.81 0 bottom
R58  84.2,30.35 0 bottom
R59  84.2,32.89 0 bottom
REG1  8.89,45.85 0 top
S1  34.67,88.26 0 top
U1  43.56,48.39 270 top
U2  109.98,60.32 90 top
U3  87.63,78.61 270 top
U4  115.32,39.24 180 top
U5  79.38,15.11 0 top
Y1  46.61,65.15 180 top

### Tracks (layer width: path | path; a pad name or v marks a point on that pad's centre or on a via)
+3V3  (via drill 0.35)  (1 unrouted)
  Top 0.152: 16.64,36.96 C16.1
  Top 0.305: C5.1 30.83,51.14 U1.19 39.16,51.14 39.18,51.12 | 39.18,51.12 39.5,50.8 39.5,45.59 | 39.5,45.59 38.54,44.64 U1.32 29.15,44.64 C4.1 v23.37,44.71 v23.37,44.7 | U1.13 41.31,53.25 39.18,51.12 | 39.5,45.59 40.39,44.7 46.48,44.7 47.31,43.88 U1.48 47.31,41.33 49.66,38.99 C1.1 | 47.31,53.27 U1.1 | 47.31,53.27 48.45,52.14 U1.64 50.48,52.14 C3.1 53.98,54.86 53.98,52.96 v54.36,52.58 | R43.1 23.56,78.58 LED1.A LED2.A LED3.A 26.16,68.86 26.16,64.52 27.56,63.12 32.13,63.12 C2.1 35.31,58.04 36.7,56.64 39.62,56.64 41.31,54.95 U1.13 | JP5.3 28.41,17.63 C6.1 15.36,35.69 C16.1 | R1.2 R2.2 71.84,89.58 73.79,87.63 73.79,78.23 v76.07,75.95 76.07,65.28 v76.33,65.02 | IC1.2 92.58,64.26 v90.93,62.61 | U1.13 41.31,53.31 42.3,52.32 46.36,52.32 47.31,53.27 | v101.6,21.08 101.6,24.64 101.1,25.14 IC2.2 v102.99,25.14 v103,25.15 | REG1.3 16.74,41.81 | v16.64,41.91 16.64,36.96
  Bottom 0.305: JP5.3 JP5.2 JP5.1 32.6,4.7 50.16,4.7 JP10.1 | R26.1 78.32,63.88 79.59,62.61 v90.93,62.61 90.93,56.9 88.39,54.36 88.39,51.31 87.5,50.42 87.5,45.08 91.31,41.27 96.65,41.27 99.1,38.82 R21.1 103,33.95 v103,25.15 | R20.1 77.17,74.84 v76.07,75.95 | R26.1 78.32,54.57 JP1.8 JP1.7 66.17,48.77 60.33,48.77 56.52,52.58 v54.36,52.58 | R26.1 v76.33,65.02 | v101.6,21.08 101.6,17.87 99.19,15.45 R25.1 | v16.64,41.91 18.41,43.69 22.35,43.69 v23.37,44.7
BOOT0
  Bottom 0.152: R19.1 54.86,22.1 58.04,18.92 JP10.2
BUF1
  Top 0.305: JP2.1 119.25,58.93 95.88,58.93 U2.2
  Bottom 0.305: U2.2 R11.2
BUF2
  Top 0.305: JP2.2 119.25,61.47 121.16,61.47 121.79,60.83 121.79,59.56 120.4,58.17 97.66,58.17 U2.3
  Bottom 0.305: R12.2 U2.3
BUF2_1
  Bottom 0.305: R51.2 U4.18 116.46,20.32 116.46,15.37 109.47,8.38 JP3.1
BUF2_2
  Bottom 0.305: R50.2 U4.17 117.22,22.1 117.22,14.86 108.2,5.84 JP3.2
BUF2_3
  Bottom 0.305: R49.2 U4.16 117.98,23.88 117.98,14.35 108.2,4.57 106.17,4.57 105.54,5.21 105.54,7.11 JP3.3
BUF2_4
  Bottom 0.305: R48.2 U4.15 118.74,25.65 118.74,13.84 108.71,3.81 105.92,3.81 104.27,5.46 JP3.4
BUF2_5
  Bottom 0.305: R47.2 U4.14 119.51,27.43 119.51,13.33 109.35,3.17 105.03,3.17 103,5.21 103,7.11 JP3.5
BUF2_6
  Bottom 0.305: R46.1 U4.13 115.32,33.15 120.27,28.19 120.27,12.83 109.98,2.54 104.39,2.54 101.73,5.21 JP3.6
BUF2_7
  Bottom 0.305: R45.2 U4.12 121.03,30.99 121.03,12.19 110.62,1.78 103.89,1.78 100.46,5.21 100.46,6.98 99.19,8.25 JP3.7
BUF2_8
  Bottom 0.305: R44.2 U4.11 121.79,32.77 121.79,11.68 111.25,1.14 103.38,1.14 99.19,5.33 JP3.8
BUF2_9
  Bottom 0.305: R59.2 U5.18 73.02,26.54 73.02,10.54 82.8,0.76 93.47,0.76 97.92,5.21 97.92,7.11 JP3.9
BUF2_10
  Bottom 0.305: R58.2 U5.17 73.91,24.89 73.91,10.79 83.31,1.4 92.71,1.4 96.65,5.33 JP3.10
BUF2_11
  Bottom 0.305: R57.2 U5.16 74.68,23.11 74.68,11.18 83.82,2.03 92.2,2.03 95.38,5.21 95.38,7.11 JP3.11
BUF2_12
  Bottom 0.305: R56.2 U5.15 75.44,21.34 75.44,11.56 84.33,2.67 91.31,2.67 94.11,5.46 JP3.12
BUF2_13
  Bottom 0.305: R55.2 U5.14 76.2,19.56 76.2,11.94 84.84,3.3 90.93,3.3 92.84,5.21 92.84,7.11 JP3.13
BUF2_14
  Bottom 0.305: R54.1 U5.13 76.96,17.78 76.96,12.32 85.34,3.94 90.3,3.94 91.57,5.21 JP3.14
BUF2_15
  Bottom 0.305: R53.2 U5.12 77.85,16.13 77.85,12.57 85.85,4.57 89.66,4.57 90.3,5.21 90.3,7.11 JP3.15
BUF2_16
  Bottom 0.305: R52.2 U5.11 79.38,12.32 85.85,5.84 JP3.16
BUF3
  Top 0.305: JP2.3 121.28,62.74 122.43,61.59 122.43,58.93 120.9,57.4 99.44,57.4 U2.4
  Bottom 0.305: R13.2 U2.4
BUF4
  Top 0.305: JP2.4 119.25,64.01 121.28,64.01 123.06,62.23 123.06,58.55 121.28,56.77 101.35,56.77 U2.5
  Bottom 0.305: R14.2 U2.5
BUF5
  Top 0.305: JP2.5 121.41,65.28 123.7,62.99 123.7,58.17 121.54,56.01 103.12,56.01 U2.6
  Bottom 0.305: R15.2 99.85,52.67 U2.6
BUF6
  Top 0.305: JP2.6 119.25,66.55 121.41,66.55 124.33,63.63 124.33,57.78 121.92,55.37 105.03,55.37 U2.7
  Bottom 0.305: R16.2 102.43,52.64 U2.7
BUF7
  Top 0.305: JP2.7 121.28,67.82 124.97,64.13 124.97,57.4 122.17,54.61 106.81,54.61 U2.8
  Bottom 0.305: R17.2 104.9,48.7 U2.8
BUF8
  Top 0.305: JP2.8 119.25,69.09 121.16,69.09 125.6,64.64 125.6,57.02 122.43,53.85 108.58,53.85 U2.9
  Bottom 0.305: R18.2 U2.9
BUF9
  Top 0.305: JP2.9 121.03,70.36 125.6,74.93 125.6,80.77 121.67,84.71 108.84,84.71 107.95,85.6 U3.2
  Bottom 0.305: U3.2 R34.2
BUF10
  Top 0.305: JP2.10 119.25,71.63 121.03,71.63 124.84,75.44 124.84,80.14 120.9,84.07 106.93,84.07 105.41,85.6 U3.3
  Bottom 0.305: U3.3 R33.2
BUF11
  Top 0.305: JP2.11 121.03,72.9 124.08,75.95 124.08,79.76 120.4,83.44 105.16,83.44 102.87,85.72 U3.4
  Bottom 0.305: U3.4 R32.2
BUF12
  Top 0.305: JP2.12 119.25,74.17 121.16,74.17 123.32,76.33 123.32,79.38 120.02,82.68 103.25,82.68 100.33,85.6 U3.5
  Bottom 0.305: U3.5 R31.2
BUF13
  Top 0.305: JP2.13 121.16,75.44 122.55,76.84 122.55,79.12 119.76,81.91 101.47,81.91 97.79,85.6 U3.6
  Bottom 0.305: U3.6 R30.2
BUF14
  Top 0.305: JP2.14 119.25,76.71 121.16,76.71 121.79,77.34 121.79,78.61 119.25,81.15 99.69,81.15 95.25,85.6 U3.7
  Bottom 0.305: U3.7 R29.1
BUF15
  Top 0.305: JP2.15 117.98,80.52 97.79,80.52 92.71,85.6 U3.8
  Bottom 0.305: U3.8 R28.2
BUF16
  Top 0.305: JP2.16 116.08,79.88 95.88,79.88 90.17,85.6 U3.9
  Bottom 0.305: U3.9 R27.2
D+
  Top 0.305: J1.3 12.24,78.87 18.29,78.87 20.38,76.77 CR2.1
D-
  Top 0.305: J1.2 13.35,77.98 17.14,77.98 18.48,76.64 CR2.3
DBG_1  (via drill 0.35)
  Top 0.305: U1.33 39.81,41.08 v36.7,37.97
  Bottom 0.305: v36.7,37.97 30.73,32 15.62,32 8.89,25.27 JP9.1
DBG_2  (via drill 0.35)
  Top 0.305: U1.34 40.31,39.8 v38.86,38.35
  Bottom 0.305: v38.86,38.35 31.5,30.99 16.26,30.99 JP9.2
DBG_3  (via drill 0.35)
  Top 0.305: U1.35 40.81,41.48 41.02,41.27 41.02,38.73 v38.86,36.58
  Bottom 0.305: v38.86,36.58 32.13,29.84 17.02,29.84 11.18,24 9.27,24 JP9.3
DBG_4  (via drill 0.35)
  Top 0.305: U1.36 41.31,41.75 41.78,41.27 41.78,37.85 v40.51,36.58
  Bottom 0.305: v40.51,36.58 32.77,28.83 18.03,28.83 11.94,22.73 JP9.4
ERST1  (via drill 0.35)
  Top 0.305: IC1.3 93.23,67.93 91.82,69.34 v89.79,69.34 | U1.25 36.45,48.14 v35.31,49.28
  Bottom 0.305: v89.79,69.34 83.52,69.34 R20.2 76.67,70.44 68.45,62.23 38.35,62.23 36.58,60.45 36.58,56.39 35.31,55.12 v35.31,49.28
ERST2  (via drill 0.35)
  Top 0.305: IC2.3 98.54,25.79 97.92,26.42 97.92,32 v96.27,33.66 | U1.53 50.71,46.64 51.22,47.14 57,47.14 v59.56,44.58
  Bottom 0.305: v96.27,33.66 94.7,35.22 R21.2 90.8,37.85 85.98,42.67 61.47,42.67 v59.56,44.58
GEN  (via drill 0.35)
  Top 0.305: U1.20 34.51,50.64 33.53,49.66 v33.53,47.37 | v33.53,43.05 33.53,39.37 40.13,32.77 v41.4,32.77
  Bottom 0.305: JP7.1 JP7.2 JP7.3 46.61,27.56 v41.4,32.77 | v33.53,47.37 v33.53,43.05
GND  (via drill 0.35)
  Bottom 0.305: JP6.3 JP6.2 JP6.1
  other vias: 38.23,58.17
  pour Top: -0.13,94.49 -0.13,0 126.24,0 126.24,94.49
  pour Bottom: -0.13,94.49 -0.13,0 126.24,0 126.24,94.49
IN0
  Top 0.305: U2.18 93.88,62 IC1.4
IN1
  Top 0.305: IC1.5 94.53,60.66 94.74,60.45 U2.17
IN2
  Top 0.305: U2.16 95.18,62.43 IC1.6
IN3
  Top 0.305: IC1.7 95.83,64.06 99.57,60.32 U2.15
IN4
  Top 0.305: IC1.8 96.48,64.56 98.93,62.1 100.58,62.1 U2.14
IN5
  Top 0.305: IC1.9 97.13,65.05 99.19,62.99 102.23,62.99 U2.13
IN6
  Top 0.305: IC1.10 97.78,65.16 99.31,63.63 104.14,63.63 U2.12
IN7
  Top 0.305: IC1.11 98.43,65.27 99.44,64.26 106.05,64.26 U2.11
IN8
  Top 0.305: U3.18 99.02,72.22 99.02,72.09 IC1.13
IN9
  Top 0.305: U3.17 98.43,74.17 IC1.14
IN10
  Top 0.305: U3.16 97.78,76.06 IC1.15
IN11
  Top 0.305: U3.15 97.13,77.95 IC1.16
IN12
  Top 0.305: U3.14 96.48,77.38 IC1.17
IN13
  Top 0.305: U3.13 95.83,75.49 IC1.18
IN14
  Top 0.305: IC1.19 95.18,74.24 90.8,78.61 U3.12
IN15
  Top 0.305: IC1.20 94.53,73.49 91.06,76.96 89.53,76.96 87.88,78.61 U3.11
INT1  (via drill 0.35)
  Top 0.305: IC1.1 91.17,66.15 v89.53,64.52 | U1.11 42.31,56.62 38.99,59.94 v38.35,59.94
  Bottom 0.305: v89.53,64.52 83.23,64.52 R26.2 82.72,66.55 81.7,67.56 75.56,67.56 69.09,61.09 39.5,61.09 v38.35,59.94
INT2  (via drill 0.35)
  Top 0.305: IC2.1 100.09,22.62 v99.58,22.11 | v53.21,41.91 56.13,41.91 58.17,39.88 58.17,33.53 66.8,24.89 66.8,12.83 70.1,9.52 79.88,9.52 85.72,15.37 v89.41,15.37 | v52.2,45.59 51.65,46.14 U1.52
  Bottom 0.305: v99.58,22.11 97.32,19.85 R25.2 93.89,19.85 v89.41,15.37 | v53.21,41.91 53.21,44.58 v52.2,45.59
N$1
  Top 0.305: R22.1 38.23,72.83 38.23,65.02 43.82,59.44 U1.8
N$2  (via drill 0.35)
  Top 0.305: U1.60 52.17,50.14 v53.09,51.05
  Bottom 0.305: v53.09,51.05 54.86,49.28 R19.2
N$3
  Top 0.305: LED1.C R22.2
N$4
  Top 0.305: R23.1 36.83,70.67 36.83,65.28 43.31,58.8 U1.9
N$5
  Top 0.305: LED2.C 33.02,72.58 R23.2
N$6
  Top 0.305: LED3.C R24.2
N$8
  Top 0.305: R24.1 34.99,65.98 42.81,58.15 U1.10
OSC_IN
  Top 0.254: 50.47,65.95 47.88,65.95 | U1.5 45.31,61.95 46.61,63.25 46.61,65.02 47.54,65.95
  Top 0.305: C8.1 50.47,65.95 | 47.88,65.95 Y1.1 47.54,65.95
OSC_OUT
  Top 0.254: C9.1 45.44,64.28 | Y1.3 44.81,63.65 U1.6
  Top 0.305: 45.44,64.28 Y1.3
OUT0
  Top 0.305: U4.2 121.67,17.65 114.43,17.65 105.64,26.44 IC2.4
OUT1
  Top 0.305: U4.3 121.54,20.07 114.55,20.07 107.53,27.09 IC2.5
OUT2
  Top 0.305: U4.4 121.67,22.73 114.55,22.73 109.55,27.74 IC2.6
OUT3
  Top 0.305: U4.5 121.67,25.27 114.68,25.27 111.56,28.39 IC2.7
OUT4
  Top 0.305: U4.6 121.54,27.69 114.43,27.69 113.07,29.04 IC2.8
OUT5
  Top 0.305: IC2.9 105.16,29.69 105.26,29.69 113.64,29.69 114.43,30.48 121.79,30.48 U4.7
OUT6
  Top 0.305: IC2.10 103.25,30.34 103.37,30.34 111.62,30.34 114.17,32.89 121.67,32.89 U4.8
OUT7
  Top 0.305: U4.9 121.67,35.43 114.3,35.43 109.86,30.99 IC2.11
OUT8
  Top 0.305: IC2.13 87.48,31.64 85.09,34.04 73.15,34.04 U5.2
OUT9
  Top 0.305: U5.3 73.02,31.62 80.52,31.62 81.15,30.99 IC2.14
OUT10
  Top 0.305: U5.4 73.02,29.08 80.26,29.08 81.52,30.34 IC2.15
OUT11
  Top 0.305: U5.5 73.02,26.54 80.14,26.54 83.29,29.69 IC2.16
OUT12
  Top 0.305: U5.6 73.02,24 80.77,24 85.81,29.04 IC2.17
OUT13
  Top 0.305: IC2.18 88.08,28.39 81.15,21.46 73.02,21.46 U5.7
OUT14
  Top 0.305: IC2.19 89.34,27.74 80.52,18.92 73.02,18.92 U5.8
OUT15
  Top 0.305: IC2.20 91.1,27.09 80.39,16.38 73.02,16.38 U5.9
RST  (via drill 0.35)
  Top 0.305: U1.7 44.31,60.08 39.37,65.02 39.37,79.88 41.91,82.42 | 41.91,82.42 C10.1 41.8,86.76 38.35,86.76 | 38.35,86.76 S1.2 | 38.35,86.76 36.81,85.22 32.62,85.22 S1.1 25.48,86.76 R43.2 | v63.5,69.72 68.07,65.15 JP1.1 | 41.91,82.42 49.65,74.68 v54.1,74.68
  Bottom 0.305: v54.1,74.68 56.39,72.39 60.96,72.39 63.5,69.85 v63.5,69.72
SCL  (via drill 0.35)
  Top 0.305: IC1.22 93.23,73.27 90.93,75.56 v88.39,75.56 | U1.58 55.74,49.14 59.94,53.34 | R2.1 69.72,84.58 | 69.72,84.58 69.72,84.2 66.55,81.03 62.87,81.03 59.94,78.1 59.94,53.34 | IC2.22 91.58,25.79 86.87,21.08 86.87,19.81 78.74,11.68 71.37,11.68 68.96,14.1 68.96,25.91 60.45,34.42 60.45,40.77 63.5,43.81 63.5,49.78 59.94,53.34 | v72.14,82.93 70.48,84.58 69.72,84.58
  Bottom 0.305: v88.39,75.56 85.09,78.87 76.2,78.87 v72.14,82.93 68.71,86.36 59.18,86.36 56.9,84.07 55.12,84.07 JP8.2
SDA  (via drill 0.35)
  Top 0.305: IC1.23 92.58,72.78 91.57,73.79 v90.93,73.79 | JP8.1 63.84,85.6 64.18,85.26 | 64.18,85.26 R1.1 v64.26,82.68 | U1.59 53.96,49.64 56.13,51.82 56.13,55.37 | 56.13,55.37 56.13,77.22 64.18,85.26 | IC2.23 92.45,25.14 87.76,20.45 87.76,19.18 79.25,10.67 70.74,10.67 67.94,13.46 67.94,25.4 59.31,34.04 59.31,41.53 62.1,44.32 62.1,49.4 v60.2,51.31 | v58.17,53.34 56.13,55.37
  Bottom 0.305: v64.26,82.68 69.21,77.72 84.07,77.72 88.01,73.79 v90.93,73.79 | v60.2,51.31 v58.17,53.34
SWCLK  (via drill 0.35)
  Top 0.305: U1.49 50.58,44.64 51.09,44.13 56.83,44.13 v57.4,44.7 | v64.77,47.24 65.41,47.88 65.41,51.56 67.06,53.21 69.09,53.21 70.36,54.48 JP1.2
  Bottom 0.305: v57.4,44.7 59.94,47.24 64.64,47.24 64.77,47.12 v64.77,47.24
SWDIO  (via drill 0.35)
  Top 0.305: U1.46 46.31,39.41 49.02,36.7 v56.52,36.7 | v62.23,36.7 66.8,41.27 66.8,50.04 67.44,50.67 69.34,50.67 JP1.4
  Bottom 0.305: v62.23,36.7 v56.52,36.7
USART_RX  (via drill 0.35)
  Top 0.305: v32.13,57.28 32.13,56.13 36.13,52.14 U1.17
  Bottom 0.305: JP8.4 52.96,88.14 43.94,79.12 43.94,72.64 32.13,60.83 v32.13,57.28
USART_TX  (via drill 0.35)
  Top 0.305: U1.16 39.81,54.9 39.08,55.63 35.43,55.63 v34.42,56.64
  Bottom 0.305: v34.42,56.64 34.42,61.72 44.7,72.01 44.7,78.61 52.96,86.87 54.99,86.87 56.13,88.01 JP8.3
USB_DM
  Top 0.305: U1.44 45.31,39.85 43.69,38.23 43.69,32.77 40.77,29.84 27.69,29.84 21.34,36.2 21.34,63.75 18.1,66.99 18.1,68.66 18.48,69.04 CR2.4
USB_DP  (via drill 0.35)
  Top 0.305: U1.45 45.81,39.46 44.32,37.97 44.32,32.51 41.02,29.21 27.43,29.21 20.7,35.94 20.7,62.36 v18.29,64.77 | CR2.6 20.38,69.04 20.7,68.72 v20.7,67.18
  Bottom 0.305: v20.7,67.18 v18.29,64.77
VCC  (via drill 0.35)  (1 unrouted)
  Top 0.152: 10.35,57.47 C11.1
  Top 0.305: J1.1 12.82,62.87 16,59.69 | JP4.2 12.95,11.43 3.43,20.95 3.43,39.93 5.31,41.81 | U3.20 110.23,78.61 C15.2 103.63,72.77 100.71,69.85 92.96,69.85 91.93,70.88 IC1.24 90.06,72.03 | C18.1 82.55,41.15 82.49,41.08 | C18.1 82.55,49.66 84.07,51.18 84.07,56.26 82.8,57.53 C12.1 84.33,57.53 U2.20 88.01,61.21 88.01,69.98 90.06,72.03 | IC2.21 95.48,26.44 95.54,26.5 | 95.54,26.5 96.14,25.91 96.14,25.02 95.61,24.49 IC2.24 94.22,23.73 92.07,21.59 C14.2 93.85,20.7 96.77,17.78 102.11,17.78 C17.1 108.33,16.38 U4.20 | JP1.10 73.28,46.99 81.16,46.99 82.55,45.59 C18.1 | 95.54,26.5 96.27,27.23 96.27,31.75 94.74,33.27 90.42,33.27 82.61,41.08 82.49,41.08 | JP4.3 22.48,13.97 v25.4,16.89 | v29.84,20.07 31.37,20.07 38.23,26.92 43.69,26.92 51.05,34.29 v56.52,34.29 | v65.41,37.21 68.07,39.88 JP1.9 | U5.20 82.49,41.08 | CR2.5 19.43,67.82 v19.3,67.69 | C13.1 82.55,79.54 90.06,72.03 | C11.1 14.35,58.17 15.88,59.69 C7.1 | REG1.1 5.31,41.81 | 5.31,41.81 4.45,42.67 4.45,51.56 10.35,57.47
  Bottom 0.305: v19.3,67.69 15.88,67.69 12.82,70.75 J1.1 | JP4.3 JP4.2 JP4.1 | JP1.10 JP1.9 | v25.4,16.89 28.57,20.07 v29.84,20.07 | v65.41,37.21 62.48,34.29 v56.52,34.29

### Text on the board
tPlace: RX | TX | SCL | SDA | 15 | 16 | 14 | 13 | 11 | 12 | 10 | 9 | 8 | 7 | OSC_IN | 6 | 5 | 4 | 3 | 2 | 1 | RST | SWCLK | 3V3 | SWDIO | GND | GND | 3V3 | 3V3 | VCC | VCC | DBG | BOOT | 2 | 4 | 6 | 8 | 10 | 12 | 14 | 16 | +5V | GND | CLK | +3V3 | 1 | 3 | 5 | 7 | 9 | 11 | 13 | 15